# EasyEDA Pro project ProPrj_Motor Driver Board v5.3.7.epro, schematic Schematic1

## Sheets
1 P1: Board Name: Motor Driver Board v5; Create Date: 2026-01-16; Page Name: P1; Project Name: Motor Driver Board v5; Schematic Name: Schematic1; Update Date: 2026-01-19; Company: IEEE Robotics @ UT Dallas; Page Size: A4; Version: V5.3
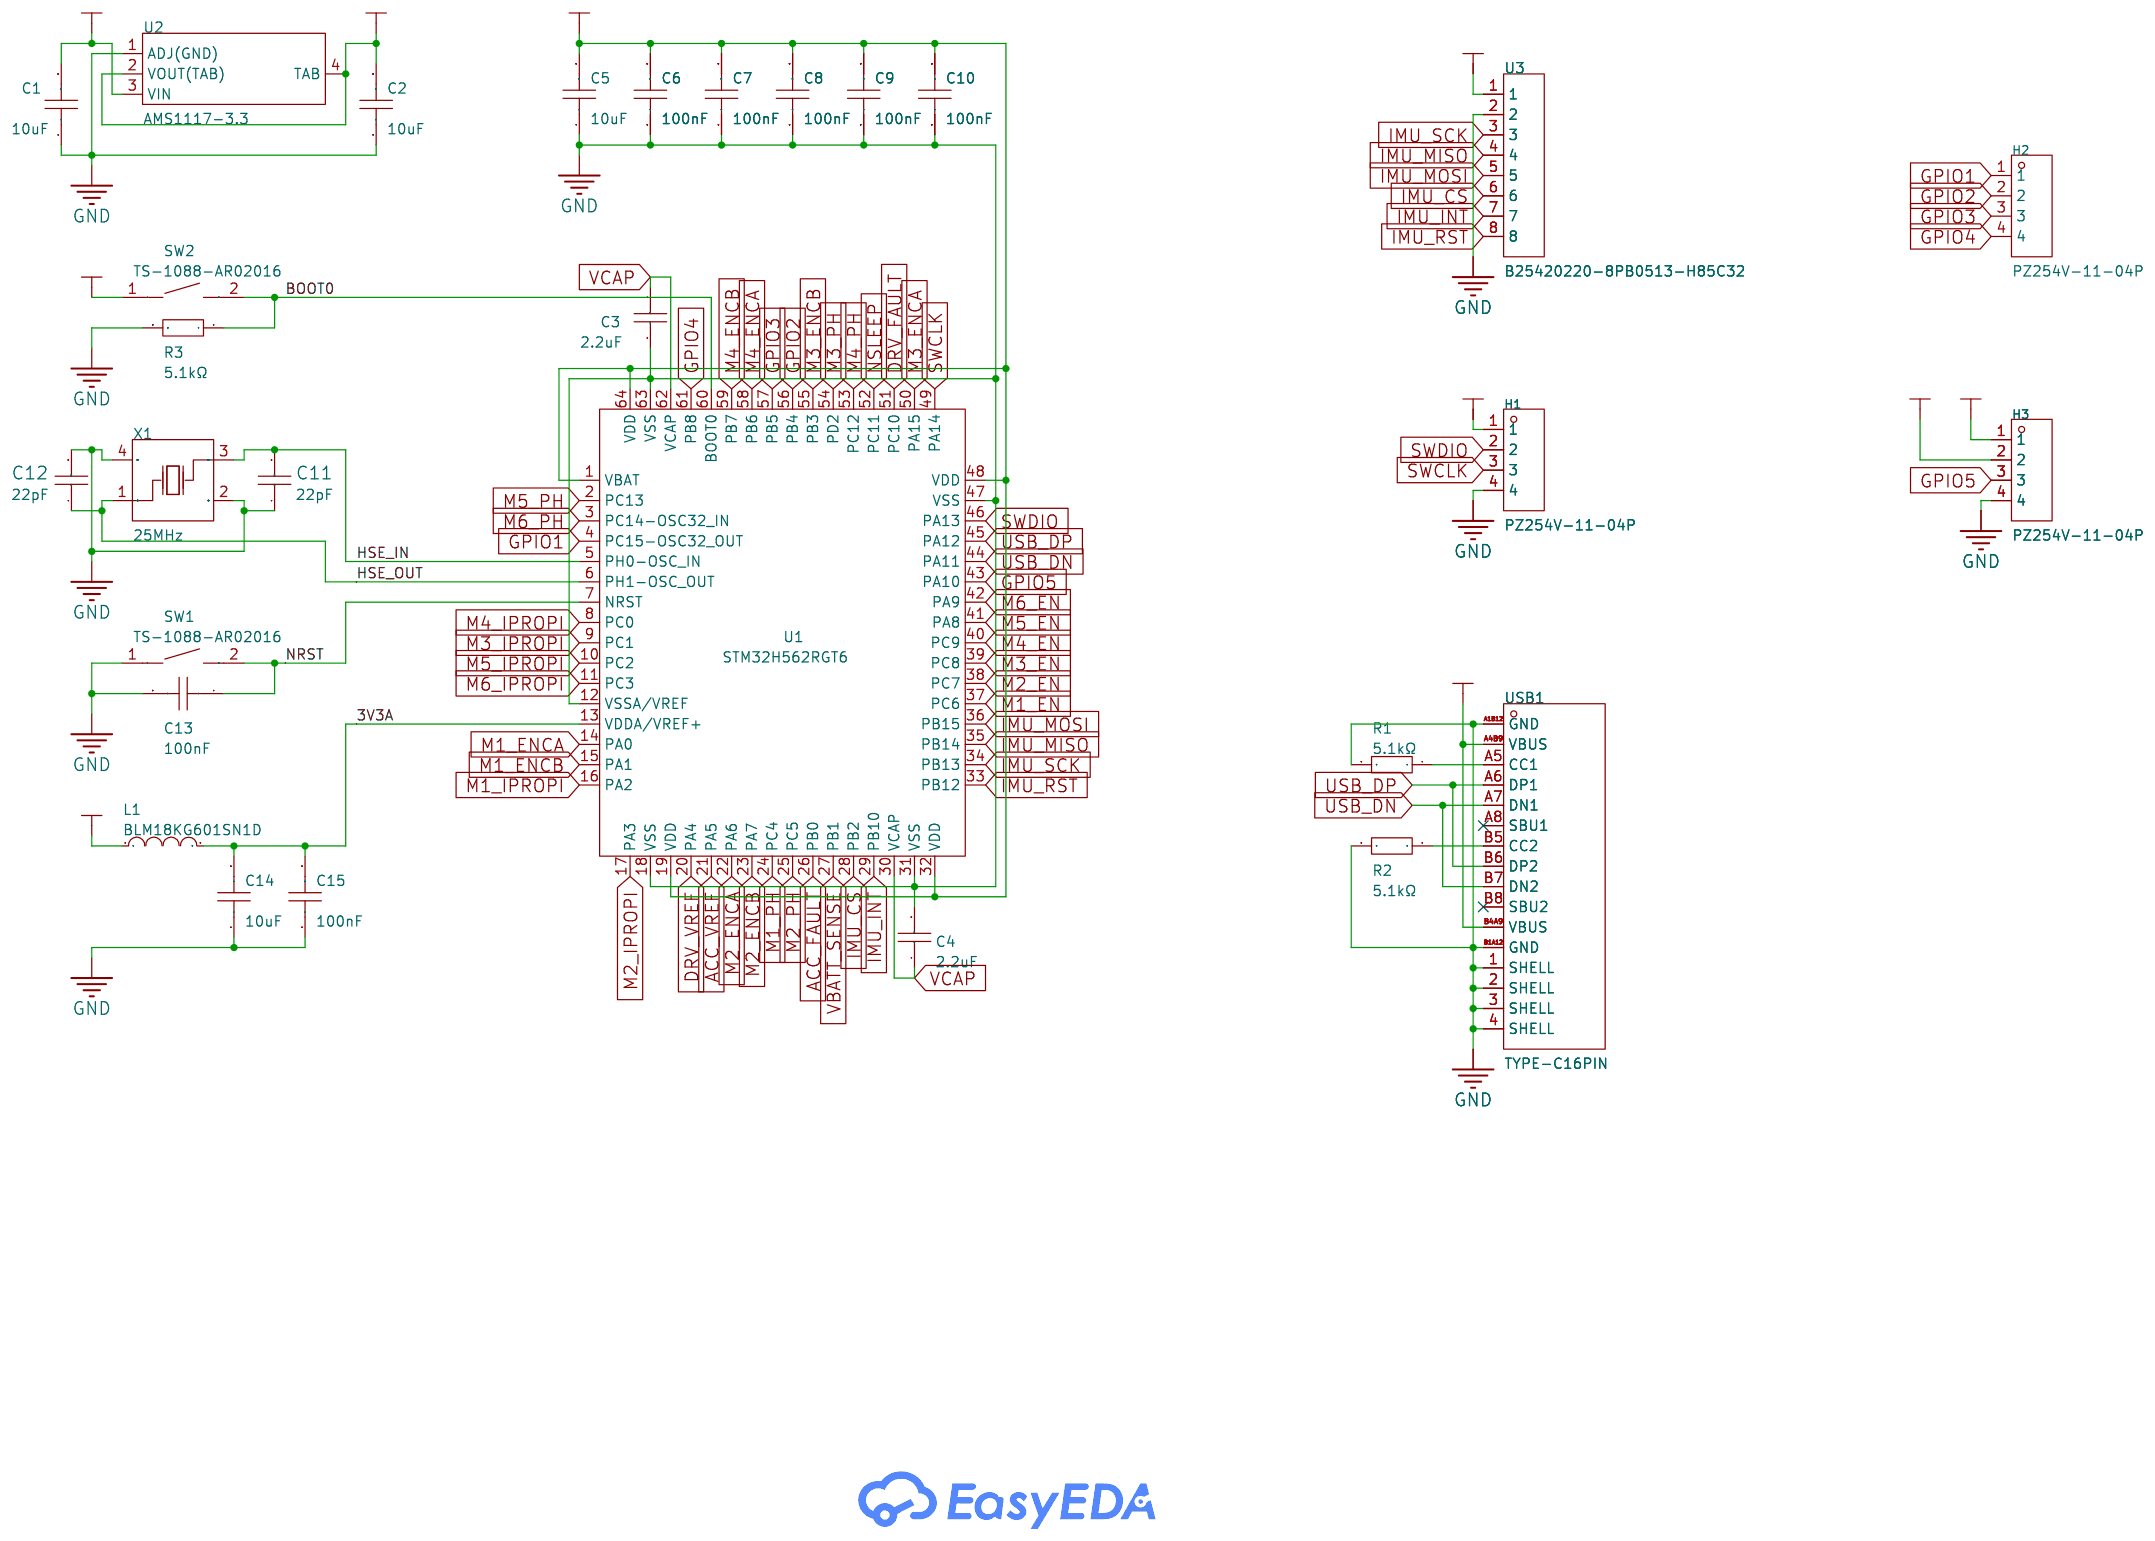
[diagram p2: P1]
2 P2: Page Name: P2; Company: EasyEDA.com; Version: V1.0
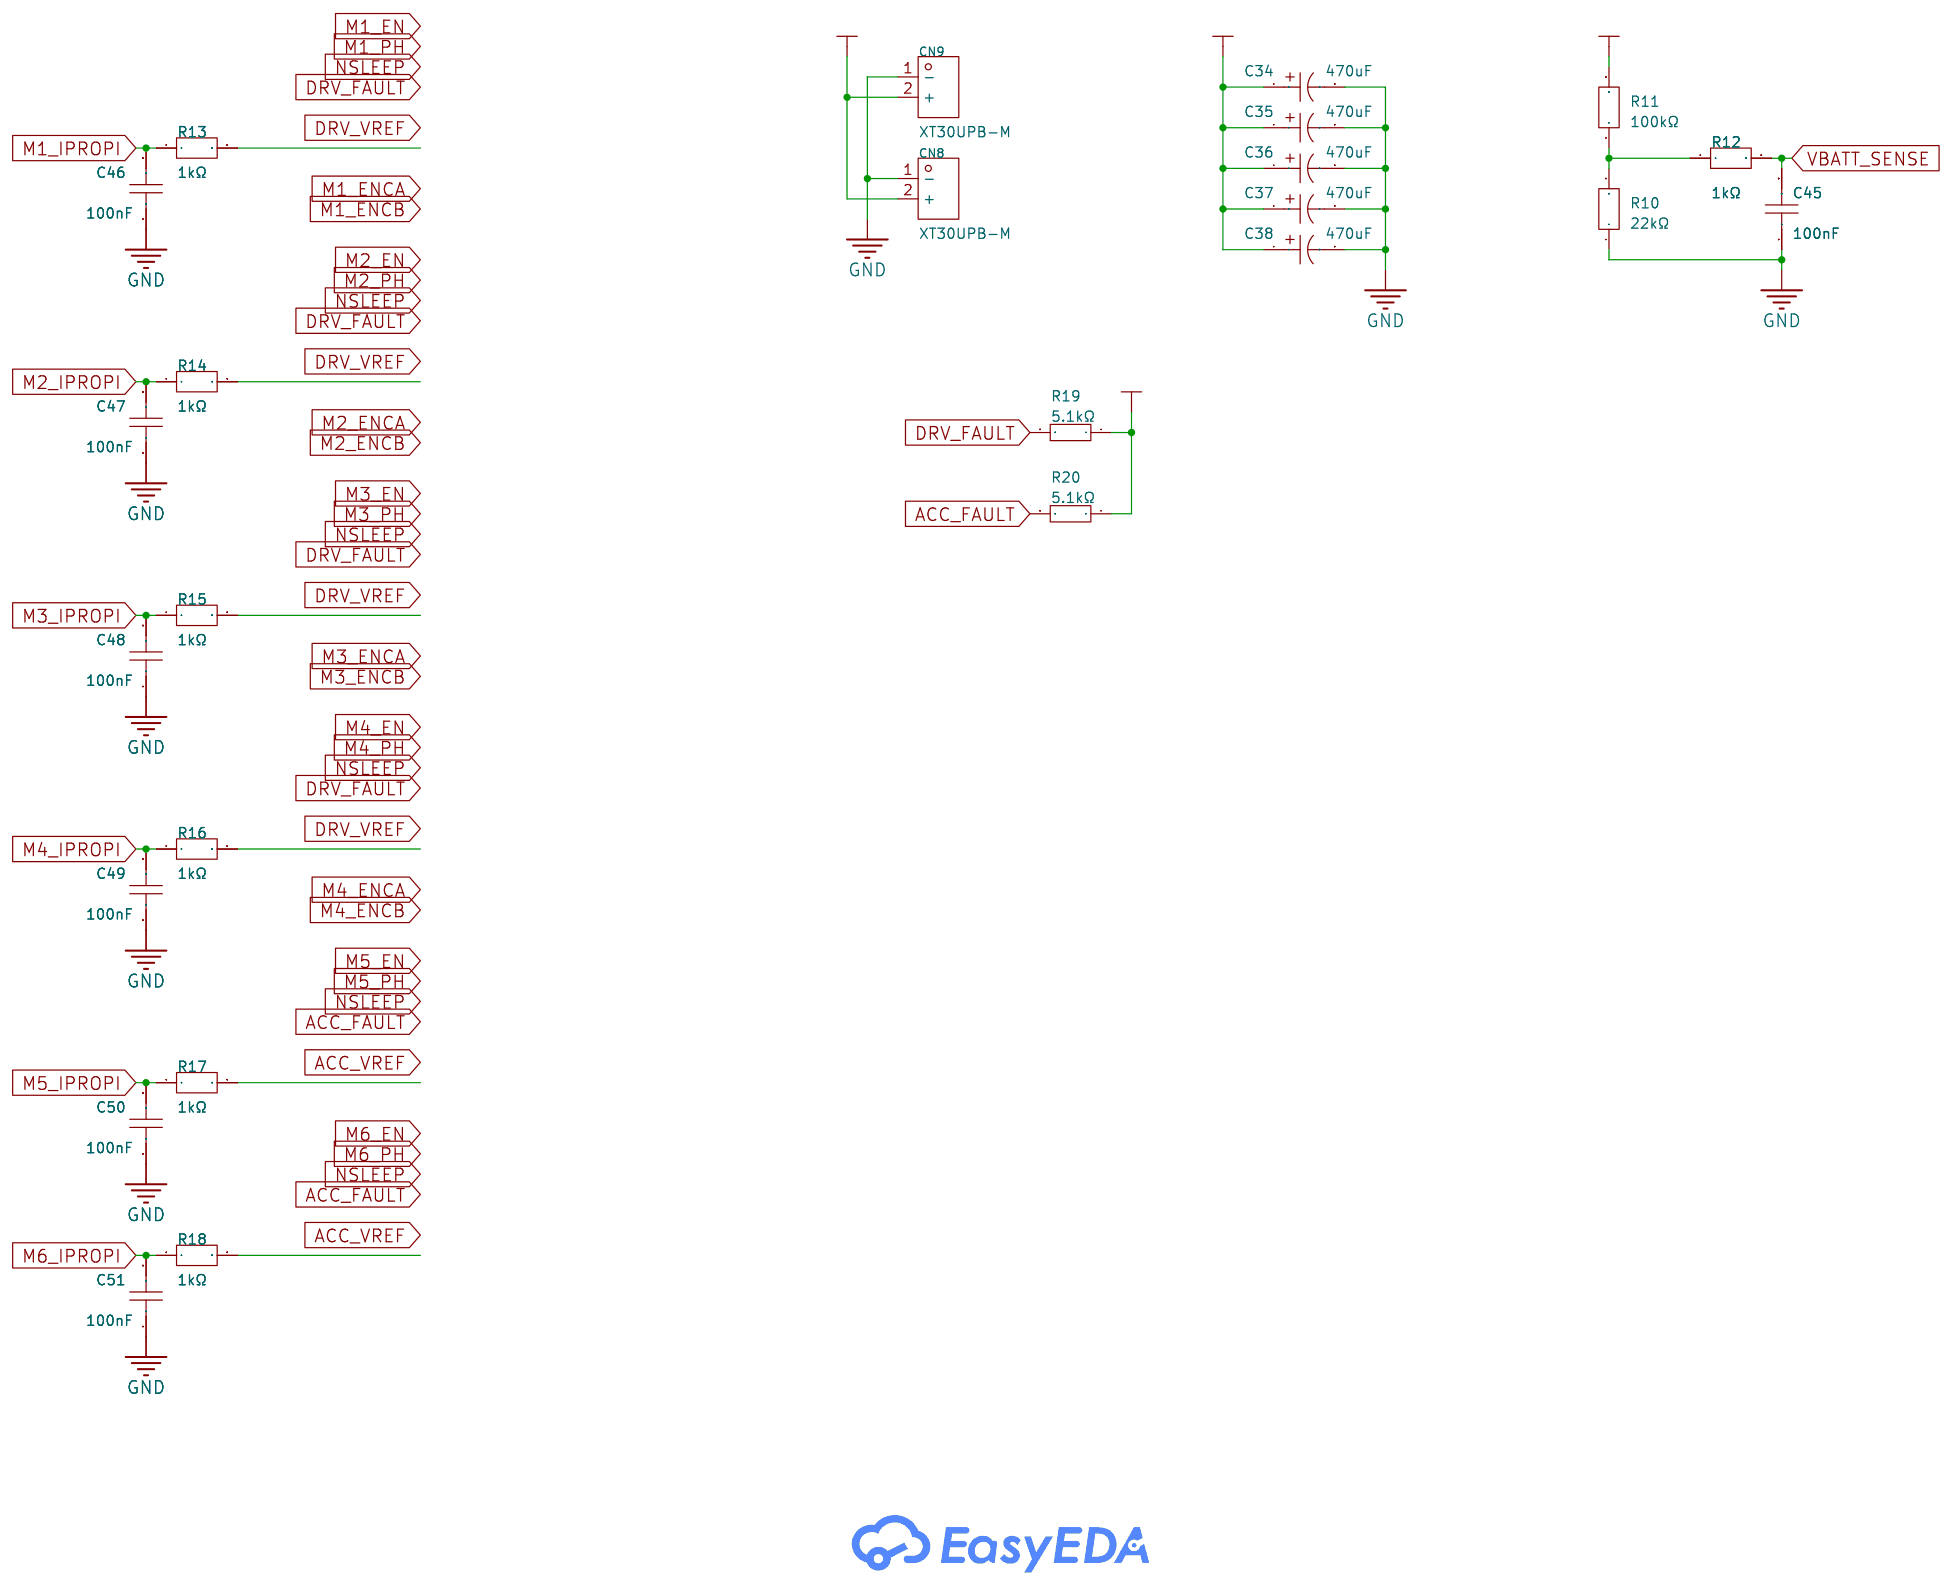
[diagram p3: P2]

## Parts
sheet P1
C1  10uF  [C0805]
C2  10uF  [C0805]
C3  2.2uF  [C0603]
C4  2.2uF  [C0603]
C5  10uF  [C0805]
C6  100nF  [C0603]
C7  100nF  [C0603]
C8  100nF  [C0603]
C9  100nF  [C0603]
C10  100nF  [C0603]
C11  22pF  [C0603]
C12  22pF  [C0603]
C13  100nF  [C0603]
C14  10uF  [C0805]
C15  100nF  [C0603]
H1  PZ254V-11-04P  [HDR-TH_4P-P2.54-V-M]
H2  PZ254V-11-04P  [HDR-TH_4P-P2.54-V-M]
H3  PZ254V-11-04P  [HDR-TH_4P-P2.54-V-M]
L1  BLM18KG601SN1D  [L0603]
R1  5.1kΩ  [R0603]
R2  5.1kΩ  [R0603]
R3  5.1kΩ  [R0603]
SW1  TS-1088-AR02016  [SW-SMD_L3.9-W3.0-P4.45]
SW2  TS-1088-AR02016  [SW-SMD_L3.9-W3.0-P4.45]
U1  STM32H562RGT6  [LQFP-64_L10.0-W10.0-P0.50-LS12.0-BL]
U2  AMS1117-3.3  [SOT-223-4_L6.5-W3.5-P2.30-LS7.0-BR]
U3  B25420220-8PB0513-H85C32  [HDR-TH_B25420220-8PB0513-H85C32]
USB1  TYPE-C16PIN  [USB-C-SMD_TYPE-C16PIN]
X1  25MHz  [CRYSTAL-SMD_4P-L3.2-W2.5-BL]
sheet P2
C34  470uF  [CAP-TH_BD6.3-P2.50-D0.6-FD-1]
C35  470uF  [CAP-TH_BD6.3-P2.50-D0.6-FD-1]
C36  470uF  [CAP-TH_BD6.3-P2.50-D0.6-FD-1]
C37  470uF  [CAP-TH_BD6.3-P2.50-D0.6-FD-1]
C38  470uF  [CAP-TH_BD6.3-P2.50-D0.6-FD-1]
C45  100nF  [C0603]
C46  100nF  [C0603]
C47  100nF  [C0603]
C48  100nF  [C0603]
C49  100nF  [C0603]
C50  100nF  [C0603]
C51  100nF  [C0603]
CBB1  -
CBB2  -
CBB3  -
CBB4  -
CBB5  -
CBB6  -
CN8  XT30UPB-M  [CONN-TH_XT30UPB-M]
CN9  XT30UPB-M  [CONN-TH_XT30UPB-M]
R10  22kΩ  [R0603]
R11  100kΩ  [R0603]
R12  1kΩ  [R0603]
R13  1kΩ  [R0603]
R14  1kΩ  [R0603]
R15  1kΩ  [R0603]
R16  1kΩ  [R0603]
R17  1kΩ  [R0603]
R18  1kΩ  [R0603]
R19  5.1kΩ  [R0603]
R20  5.1kΩ  [R0603]

## Library data of the parts
C1 C2 C5 C14 = CL21A106KAYNNNE_C15850: Capacitance:10uF Tolerance:±10% Tolerance:±10% Voltage Rating:25V Temperature Coefficient:X5R; LCSC Part Name: 10uF ±10% 25V; Supplier Part: C15850; Manufacturer: SAMSUNG(三星); Manufacturer Part: CL21A106KAYNNNE; Supplier Footprint: 0805; JLCPCB Part Class: Basic Part; Datasheet: https://item.szlcsc.com/datasheet/CL21A106KAYNNNE/16532.html; Supplier: LCSC; Tolerance: ±10%; Voltage Rating: 25V; Temperature Coefficient: X5R
C3 C4 = CL10A225KO8NNNC: Capacitance:2.2uF Tolerance:±10% Tolerance:±10% Voltage Rating:16V Temperature Coefficient:X5R; LCSC Part Name: 2.2uF ±10% 16V; Supplier Part: C23630; Manufacturer: SAMSUNG(三星); Supplier Footprint: 0603; JLCPCB Part Class: Basic Part; Datasheet: https://item.szlcsc.com/datasheet/CL10A225KO8NNNC/24366.html; Supplier: LCSC; Tolerance: ±10%; Voltage Rating: 16V; Temperature Coefficient: X5R
C6-C10 C13 C15 C45-C51 = CC0603KRX7R9BB104: Capacitance:100nF Tolerance:±10% Tolerance:±10% Voltage Rating:50V Temperature Coefficient:X7R; LCSC Part Name: 100nF ±10% 50V; Supplier Part: C14663; Manufacturer: YAGEO(国巨); Supplier Footprint: 0603; JLCPCB Part Class: Basic Part; Datasheet: https://item.szlcsc.com/datasheet/CC0603KRX7R9BB104/15331.html; Supplier: LCSC; Tolerance: ±10%; Voltage Rating: 50V; Temperature Coefficient: X7R
C11 C12 = CC0603JRNPO9BN220: Capacitance:22pF Tolerance:±5% Tolerance:±5% Voltage Rating:50V Temperature Coefficient:NP0; LCSC Part Name: 22pF ±5% 50V; Supplier Part: C105620; Manufacturer: YAGEO(国巨); Supplier Footprint: 0603; JLCPCB Part Class: Extended Part; Datasheet: https://item.szlcsc.com/datasheet/CC0603JRNPO9BN220/106835.html; Supplier: LCSC; Tolerance: ±5%; Voltage Rating: 50V; Temperature Coefficient: NP0
H1-H3 = PZ254V-11-04P: Pin Structure:1x4P Pitch:2.54mm Row Spacing:- Circluar Pins/Square Pins:Pin Header Mounting Type:Through Hole Number of Rows:1 Number of Pins:4P Current Rating:3A Voltage Rating (Max):250V Length of Mating Pin:6mm Insulation Height:2.5mm Length of End Con; LCSC Part Name: 1x4P 间距:2.54mm 方针 直插; Supplier Part: C2691448; Manufacturer: XFCN(兴飞); Supplier Footprint: 插件,P=2.54mm; JLCPCB Part Class: Extended Part; Datasheet: https://item.szlcsc.com/datasheet/PZ254V-11-04P/2801085.html; Supplier: LCSC; Pin Structure: 1x4P; Pitch: 2.54mm; Circluar Pins/Square Pins: Pin Header; Mounting Type: Through Hole; Number of Rows: 1; Number of Pins: 4P; Current Rating: 3A; Voltage Rating (Max): 250V; Length of Mating Pin: 6mm; Insulation Height: 2.5mm; Length of End Connection Pin: 3mm; Operating Temperature: -40℃~+105℃; Color: Black
L1 = BLM18KG601SN1D: Impedance @ Frequency:600Ω@100MHz Tolerance:±25% Tolerance:±25% DC Resistance(DCR):150mΩ Current Rating:1.3A Number of Circuits:1 Operating Temperature:-55℃~+125℃ Operating Temperature:-55℃~+125℃; LCSC Part Name: 单路 0603磁珠 阻抗600Ω@100MHz; Supplier Part: C85833; Manufacturer: muRata(村田); Supplier Footprint: 0603; JLCPCB Part Class: Extended Part; Datasheet: https://item.szlcsc.com/datasheet/BLM18KG601SN1D/87009.html; Supplier: LCSC; Impedance @ Frequency: 600Ω@100MHz; Tolerance: ±25%; DC Resistance(DCR): 150mΩ; Current Rating: 1.3A; Number of Circuits: 1; Operating Temperature: -55℃~+125℃
R1-R3 R19 R20 = RC0603FR-075K1L: Type:Thick Film Resistors Resistance:5.1kΩ Tolerance:±1% Tolerance:±1% Power(Watts):100mW Voltage-Supply(Max):75V Temperature Coefficient:±100ppm/℃ Temperature Coefficient:±100ppm/℃ Operating Temperature:-55℃~+155℃ Operating Temperature:-55℃~+155℃; LCSC Part Name: 厚膜电阻 5.1kΩ ±1% 100mW; Supplier Part: C105580; Manufacturer: YAGEO(国巨); Supplier Footprint: 0603; JLCPCB Part Class: Extended Part; Datasheet: https://item.szlcsc.com/datasheet/RC0603FR-075K1L/106795.html; Supplier: LCSC; Type: Thick Film Resistors; Tolerance: ±1%; Power(Watts): 100mW; Voltage-Supply(Max): 75V; Temperature Coefficient: ±100ppm/℃; Operating Temperature: -55℃~+155℃
SW1 SW2 = TS-1088-AR02016: Circuit:SPST Actuator Style:Round Button Operating Force:1.6N Mounting Type:Surface Mount,Vertical Length:4mm Width:3mm Switch Height:2mm with Bracket:Without Bracket Contact Current:50mA Voltage Rating:12V Actuator/Cap Color:Black Termination Style:SMD(S; LCSC Part Name: 4*3*2mm 立贴 轻触开关; Supplier Part: C720477; Manufacturer: XUNPU(讯普); Supplier Footprint: SMD,4x3mm; JLCPCB Part Class: Basic Part; Datasheet: https://item.szlcsc.com/datasheet/TS-1088-AR02016/763484.html; Supplier: LCSC; Circuit: SPST; Actuator Style: Round Button; Operating Force: 1.6N; Mounting Type: Surface Mount,Vertical; Length: 4mm; Width: 3mm; Switch Height: 2mm; with Bracket: Without Bracket; Contact Current: 50mA; Voltage Rating: 12V; Actuator/Cap Color: Black; Termination Style: SMD(SMT) Tab; Life: 100,000 Cycles; Operating Temperature: -30℃~+80℃
U1 = STM32H562RGT6_C19711662: LCSC Part Name: Arm Cortex-M33 32位微控制器 + TrustZone + 浮点运算单元，375 DMIPS，250 MHz，2 Mbyte闪存，640 Kbyte RAM，数学加速器; Supplier Part: C19711662; Manufacturer: ST(意法半导体); Supplier Footprint: LQFP-64(10x10); JLCPCB Part Class: Extended Part; Datasheet: https://item.szlcsc.com/datasheet/STM32H562RGT6/21021031.html; Supplier: LCSC
U2 = AMS1117-3.3_C347222: Output Type:Fixed Voltage - Supply:12V Output Voltage:3.3V Output Voltage:3.3V Output Current:1A Power Supply Rejection Ratio (PSRR):60dB@(120Hz) Voltage Dropout:1.3V@(1A) standby current:5mA Noise:0.003%Vout Features:Over Current Protection Operating Tem; LCSC Part Name: 输出:3.3V 电流:1A 耐压:12V; Supplier Part: C347222; Manufacturer: UMW(友台半导体); Supplier Footprint: SOT-223; JLCPCB Part Class: Extended Part; Datasheet: https://item.szlcsc.com/datasheet/AMS1117-3.3/323882.html; Supplier: LCSC; Output Type: Fixed; Voltage - Supply: 12V; Output Voltage: 3.3V; Output Current: 1A; Power Supply Rejection Ratio (PSRR): 60dB@(120Hz); Voltage Dropout: 1.3V@(1A); standby current: 5mA; Noise: 0.003%Vout; Features: Over Current Protection; Operating Temperature: -40℃~+125℃; Output Configuration: Positive; Number of Outputs: 1
U3 = B25420220-8PB0513-H85C32: Holes Structure:1x8P Pitch:2.54mm Circular Hole / Square Hole:Square Hole Mounting Type:Through Hole Number of Rows:1 Number of Positions:8P Current Rating:3A Holes Direction:Top Insulation Height:8.5mm Contact Plating:Gold Operating Temperature:-40℃~+105; LCSC Part Name: 1x8P 间距:2.54mm 直插; Supplier Part: C42385698; Manufacturer: HMTCONN(华明通); Supplier Footprint: 插件,P=2.54mm; JLCPCB Part Class: Extended Part; Datasheet: https://item.szlcsc.com/datasheet/B25420220-8PB0513-H85C32/44307328.html; Supplier: LCSC; Holes Structure: 1x8P; Pitch: 2.54mm; Circular Hole / Square Hole: Square Hole; Mounting Type: Through Hole; Number of Rows: 1; Number of Positions: 8P; Current Rating: 3A; Holes Direction: Top; Insulation Height: 8.5mm; Contact Plating: Gold; Operating Temperature: -40℃~+105℃; PIN Length: 3.2mm
USB1 = TYPE-C16PIN: Connector Type:Type-C Protocol Standard:USB 3.1 Gender:Female Mounting Type:Surface Mount, Right Angle Number of Contacts:16P Number of Ports:1 Current Rating-Power:3A Voltage Rating:30V Connect-Disconnect Life:10,000 Cycles Detection color:Black Operatin; LCSC Part Name: Type-C 母 卧贴; Supplier Part: C393939; Manufacturer: SHOU HAN(首韩); Supplier Footprint: SMD; JLCPCB Part Class: Extended Part; Datasheet: https://item.szlcsc.com/datasheet/TYPE-C16PIN/372551.html; Supplier: LCSC; Connector Type: Type-C; Protocol Standard: USB 3.1; Gender: Female; Mounting Type: Surface Mount, Right Angle; Number of Contacts: 16P; Number of Ports: 1; Current Rating-Power: 3A; Voltage Rating: 30V; Connect-Disconnect Life: 10,000 Cycles; Detection color: Black; Operating Temperature: -40℃~+85℃
X1 = X322525MOB4SI: Type:Crystal Oscillator Frequency:25MHz Normal temperature Frequency Tolerance:±10ppm Normal temperature Frequency Tolerance:±10ppm Load Capacitance:12pF Frequency Stability:±20ppm Frequency Stability:±20ppm Operating Temperature:-40℃~+85℃ Operating Tempe; LCSC Part Name: YSX321SL 25MHZ 4P 3225 12PF ±10PPM -40~85℃ (±20PPM); Supplier Part: C9006; Manufacturer: YXC(扬兴晶振); Supplier Footprint: SMD3225-4P; JLCPCB Part Class: Basic Part; Datasheet: https://item.szlcsc.com/datasheet/X322525MOB4SI/9526.html; Supplier: LCSC; Type: Crystal Oscillator; Normal temperature Frequency Tolerance: ±10ppm; Load Capacitance: 12pF; Frequency Stability: ±20ppm; Operating Temperature: -40℃~+85℃
C34-C38 = RV471M350E160R1Z00ZZ: Capacitance:470uF Tolerance:±20% Tolerance:±20% Voltage Rating:35V Diameter:6.3mm Height - Seated (Max):16mm Lifetime:2000hrs@105℃ Operating Temperature:-55℃~+105℃ Operating Temperature:-55℃~+105℃; LCSC Part Name: 高压品，2000H at 105℃ 470uF ±20% 35V; Supplier Part: C42460434; Manufacturer: 创慧电子; Supplier Footprint: 插件,D6.3xL16mm; Datasheet: https://item.szlcsc.com/datasheet/RV471M350E160R1Z00ZZ/44544488.html; Supplier: LCSC; Tolerance: ±20%; Voltage Rating: 35V; Diameter: 6.3mm; Height - Seated (Max): 16mm; Lifetime: 2000hrs@105℃; Operating Temperature: -55℃~+105℃
CN8 CN9 = XT30UPB-M: LCSC Part Name: AMASS(艾迈斯)板载立式 航模锂电池控制器连接器插头 公头XT30UPB-M; Supplier Part: C428721; Manufacturer: AMASS(艾迈斯); JLCPCB Part Class: Extended Part; Datasheet: https://item.szlcsc.com/datasheet/XT30UPB-M/423831.html; Supplier: LCSC
R10 = FRC0603F2202TS: Type:Thick Film Resistor Resistance:22kΩ Tolerance:±1% Tolerance:±1% Power(Watts):100mW Voltage-Supply(Max):75V Temperature Coefficient:±100ppm/℃ Temperature Coefficient:±100ppm/℃ Operating Temperature:-55℃~+155℃ Operating Temperature:-55℃~+155℃; LCSC Part Name: 22kΩ ±1% 100mW 厚膜电阻; Supplier Part: C2907015; Manufacturer: FOJAN(富捷); Supplier Footprint: 0603; JLCPCB Part Class: Extended Part; Supplier: LCSC; Type: Thick Film Resistor; Tolerance: ±1%; Power(Watts): 100mW; Voltage-Supply(Max): 75V; Temperature Coefficient: ±100ppm/℃; Operating Temperature: -55℃~+155℃
R11 = FRC0603F1003TS: Type:Thick Film Resistor Resistance:100kΩ Tolerance:±1% Tolerance:±1% Power(Watts):100mW Voltage-Supply(Max):75V Temperature Coefficient:±100ppm/℃ Temperature Coefficient:±100ppm/℃ Operating Temperature:-55℃~+155℃ Operating Temperature:-55℃~+155℃; LCSC Part Name: 100kΩ ±1% 100mW 厚膜电阻; Supplier Part: C2906980; Manufacturer: FOJAN(富捷); Supplier Footprint: 0603; JLCPCB Part Class: Extended Part; Supplier: LCSC; Type: Thick Film Resistor; Tolerance: ±1%; Power(Watts): 100mW; Voltage-Supply(Max): 75V; Temperature Coefficient: ±100ppm/℃; Operating Temperature: -55℃~+155℃
R12-R18 = FRC0603F1001TS: Type:Thick Film Resistor Resistance:1kΩ Tolerance:±1% Tolerance:±1% Power(Watts):100mW Voltage-Supply(Max):75V Temperature Coefficient:±100ppm/℃ Temperature Coefficient:±100ppm/℃ Operating Temperature:-55℃~+155℃ Operating Temperature:-55℃~+155℃; LCSC Part Name: 1kΩ ±1% 100mW 厚膜电阻; Supplier Part: C2907002; Manufacturer: FOJAN(富捷); Supplier Footprint: 0603; JLCPCB Part Class: Extended Part; Supplier: LCSC; Type: Thick Film Resistor; Tolerance: ±1%; Power(Watts): 100mW; Voltage-Supply(Max): 75V; Temperature Coefficient: ±100ppm/℃; Operating Temperature: -55℃~+155℃

## Nets
3V3: C2.2 C5.2 C6.2 C7.2 C8.2 C9.2 C10.2 H1.1 H3.2 L1.1 R19.1 R20.1 SW2.1 U1.1(VBAT) U1.19(VDD) U1.32(VDD) U1.48(VDD) U1.64(VDD) U2.2(VOUT(TAB)) U2.4(TAB) U3.1
3V3A: C14.2 C15.2 L1.2 U1.13(VDDA/VREF+)
GND: C1.1 C2.1 C3.1 C4.2 C5.1 C6.1 C7.1 C8.1 C9.1 C10.1 C11.1 C12.2 C13.2 C14.1 C15.1 C34.2 C35.2 C36.2 C37.2 C38.2 C45.1 C46.1 C47.1 C48.1 C49.1 C50.1 C51.1 CN8.1(-) CN9.1(-) H1.4 H3.4 R1.2 R2.2 R3.2 R10.1 SW1.1 U1.12(VSSA/VREF) U1.18(VSS) U1.31(VSS) U1.47(VSS) U1.63(VSS) U2.1(ADJ(GND)) U3.2 USB1.1(SHELL) USB1.2(SHELL) USB1.3(SHELL) USB1.4(SHELL) USB1.A1B12(GND) USB1.B1A12(GND) X1.2(GND) X1.4(GND)
VBATT: C34.1 C35.1 C36.1 C37.1 C38.1 CN8.2(+) CN9.2(+) R11.2
VBATT_SENSE: C45.2 R12.2 U1.27(PB1)
VBUS: C1.2 H3.1 U2.3(VIN) USB1.A4B9(VBUS) USB1.B4A9(VBUS)
ACC_FAULT: CBB1.(ENCA) CBB2.(ENCA) CBB3.(ENCA) CBB4.(ENCA) CBB5.(IPROPI) CBB6.(IPROPI) R13.2 R14.2 R15.2 R16.2 R17.2 R18.2 R19.2 R20.2 U1.2(PC13) U1.3(PC14-OSC32_IN) U1.14(PA0) U1.15(PA1) U1.20(PA4) U1.21(PA5) U1.22(PA6) U1.23(PA7) U1.24(PC4) U1.25(PC5) U1.26(PB0) U1.37(PC6) U1.38(PC7) U1.39(PC8) U1.40(PC9) U1.41(PA8) U1.42(PA9) U1.50(PA15) U1.51(PC10) U1.52(PC11) U1.53(PC12) U1.54(PD2) U1.55(PB3) U1.58(PB6) U1.59(PB7)
BOOT0: R3.1 SW2.2 U1.60(BOOT0)
GPIO1: H2.1 U1.4(PC15-OSC32_OUT)
GPIO2: H2.2 U1.56(PB4)
GPIO3: H2.3 U1.57(PB5)
GPIO4: H2.4 U1.61(PB8)
GPIO5: H3.3 U1.43(PA10)
HSE_IN: C11.2 U1.5(PH0-OSC_IN) X1.3(OSC2)
HSE_OUT: C12.1 U1.6(PH1-OSC_OUT) X1.1(OSC1)
IMU_CS: U1.28(PB2) U3.6
IMU_INT: U1.29(PB10) U3.7
IMU_MISO: U1.35(PB14) U3.4
IMU_MOSI: U1.36(PB15) U3.5
IMU_RST: U1.33(PB12) U3.8
IMU_SCK: U1.34(PB13) U3.3
M1_IPROPI: C46.2 R13.1 U1.16(PA2)
M2_IPROPI: C47.2 R14.1 U1.17(PA3)
M3_IPROPI: C48.2 R15.1 U1.9(PC1)
M4_IPROPI: C49.2 R16.1 U1.8(PC0)
M5_IPROPI: C50.2 R17.1 U1.10(PC2)
M6_IPROPI: C51.2 R18.1 U1.11(PC3)
NRST: C13.1 SW1.2 U1.7(NRST)
SWCLK: H1.3 U1.49(PA14)
SWDIO: H1.2 U1.46(PA13)
USB_DN: U1.44(PA11) USB1.A7(DN1) USB1.B7(DN2)
USB_DP: U1.45(PA12) USB1.A6(DP1) USB1.B6(DP2)
VCAP: C3.2 C4.1 U1.30(VCAP) U1.62(VCAP)
$1N5317: R2.1 USB1.B5(CC2)
$1N5479: R1.1 USB1.A5(CC1)
$2N8796: R10.2 R11.1 R12.1

Not connected (* = marked no-connect by the designer): USB1 A8(SBU1)* B8(SBU2)*
